# Altium schematic sheet RF_Transceiver_LMS6002_PLL_CLK.SchDoc
size A4; DocumentNumber: 25; SheetNumber: 25; SheetTotal: 47
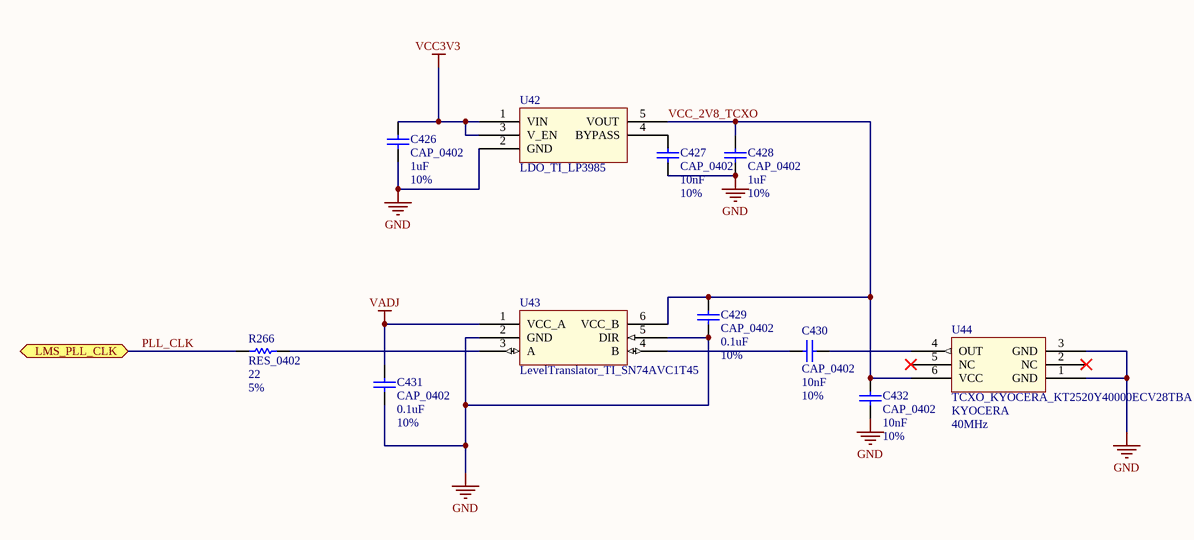
[diagram p0: RF_Transceiver_LMS6002_PLL_CLK.SchDoc]

## Parts
C426  CAP_0402  value 1uF  Tolerance: 10%  [CAPC0402(1005)60_N]
C427  CAP_0402  value 10nF  Tolerance: 10%  [CAPC0402(1005)60_N]
C428  CAP_0402  value 1uF  Tolerance: 10%  [CAPC0402(1005)60_N]
C429  CAP_0402  value 0.1uF  Tolerance: 10%  [CAPC0402(1005)60_N]
C430  CAP_0402  value 10nF  Tolerance: 10%  [CAPC0402(1005)60_N]
C431  CAP_0402  value 0.1uF  Tolerance: 10%  [CAPC0402(1005)60_N]
C432  CAP_0402  value 10nF  Tolerance: 10%  [CAPC0402(1005)60_N]
R266  RES_0402  value 22  Tolerance: 5%  [RESC0402(1005)_N]
U42  LDO_TI_LP3985  [LDO_TI_LP3985_SOT23-5]
U43  LevelTranslator_TI_SN74AVC1T45  [LevelTranslator_TI_SN74AVC1T45 _SC70-6]
U44  TCXO_KYOCERA_KT2520Y40000ECV28TBA  value 40MHz  Manufacturer: KYOCERA  [TCXO_KYOCERA_KT2520Y40000ECV28TBA_PCB-6PIN]

## Ports
LMS_PLL_CLK (bidir)

## Nets
GND: C426.1 C427.1 C428.1 C429.1 C431.2 C432.1 U42.2(GND) U43.2(GND) U43.5(DIR) U44.1(GND) U44.3(GND)
VADJ: C431.1 U43.1(VCC_A)
VCC3V3: C426.2 U42.1(VIN) U42.3(V_EN)
PLL_CLK: R266.1 ; port LMS_PLL_CLK
VCC_2V8_TCXO: C428.2 C429.2 C432.2 U42.5(VOUT) U43.6(VCC_B) U44.6(VCC)
NetC427_2: C427.2 U42.4(BYPASS)
NetC430_1: C430.1 U43.4(B)
NetC430_2: C430.2 U44.4(OUT)
NetR266_2: R266.2 U43.3(A)

Not connected (* = marked no-connect by the designer): U44 2(NC)* 5(NC)*

## Library data of the parts
C426 C428 = C1005X5R0J105K: 1uF, ceramic, 10%, 6.3V, X5R, 0402; Manufacturer: TDK Corporation; Part Number: C1005X5R0J105K; Footprint Ref: CAPC0402(1005)60_N; Library Ref: CAP_0402
C427 C430 C432 = GRM155R60J103KA01D: 10000pF, ceramic, 10% 6.3V X5R, 0402; Manufacturer: Murata Electronics North America; Part Number: GRM155R60J103KA01D; Footprint Ref: CAPC0402(1005)60_N; Library Ref: CAP_0402
C429 C431 = C1005X5R0J104K: 0.1uf, ceramic, 10%, 6.3V, X5R, 0402; Manufacturer: TDK Corporation; Part Number: C1005X5R0J104K; Footprint Ref: CAPC0402(1005)60_N; Library Ref: CAP_0402
R266 = ERJ-2GEJ220X: RES 22 OHM 1/10W 5% 0402 SMD; Manufacturer: Panasonic Electronic Components; Part Number: ERJ-2GEJ220X; Footprint Ref: RESC0402(1005)_N; Library Ref: RES_0402
U42 = LP3985IM5-2.8/NOPB: LDO_TI_LP3985,150mA,CMOS, IC REG LDO 2.8V .15A SOT-23-5; Manufacturer: Texas Instruments; Part Number: LP3985IM5-2.8/NOPB
U43 = SN74AVC1T45DCKR: Level Translator, IC BUS TRANSCVR TRI-ST SC70-6; Manufacturer: Texas Instruments; Part Number: SN74AVC1T45DCKR
U44 = KT2520Y40000ECV28TBA: TCXO_KYOCERA_KT2520Y40000ECV28TBA,40MHz,2.8V; Part Number: KT2520Y40000ECV28TBA; Footprint Ref: TCXO_KYOCERA_KT2520Y40000ECV28TBA_PCB-6PIN; Library Ref: TCXO_KYOCERA_KT2520Y40000ECV28TBA